# EAGLE design V4-AddOnESP32-V008-cc1101 (EAGLE 9.3.0)
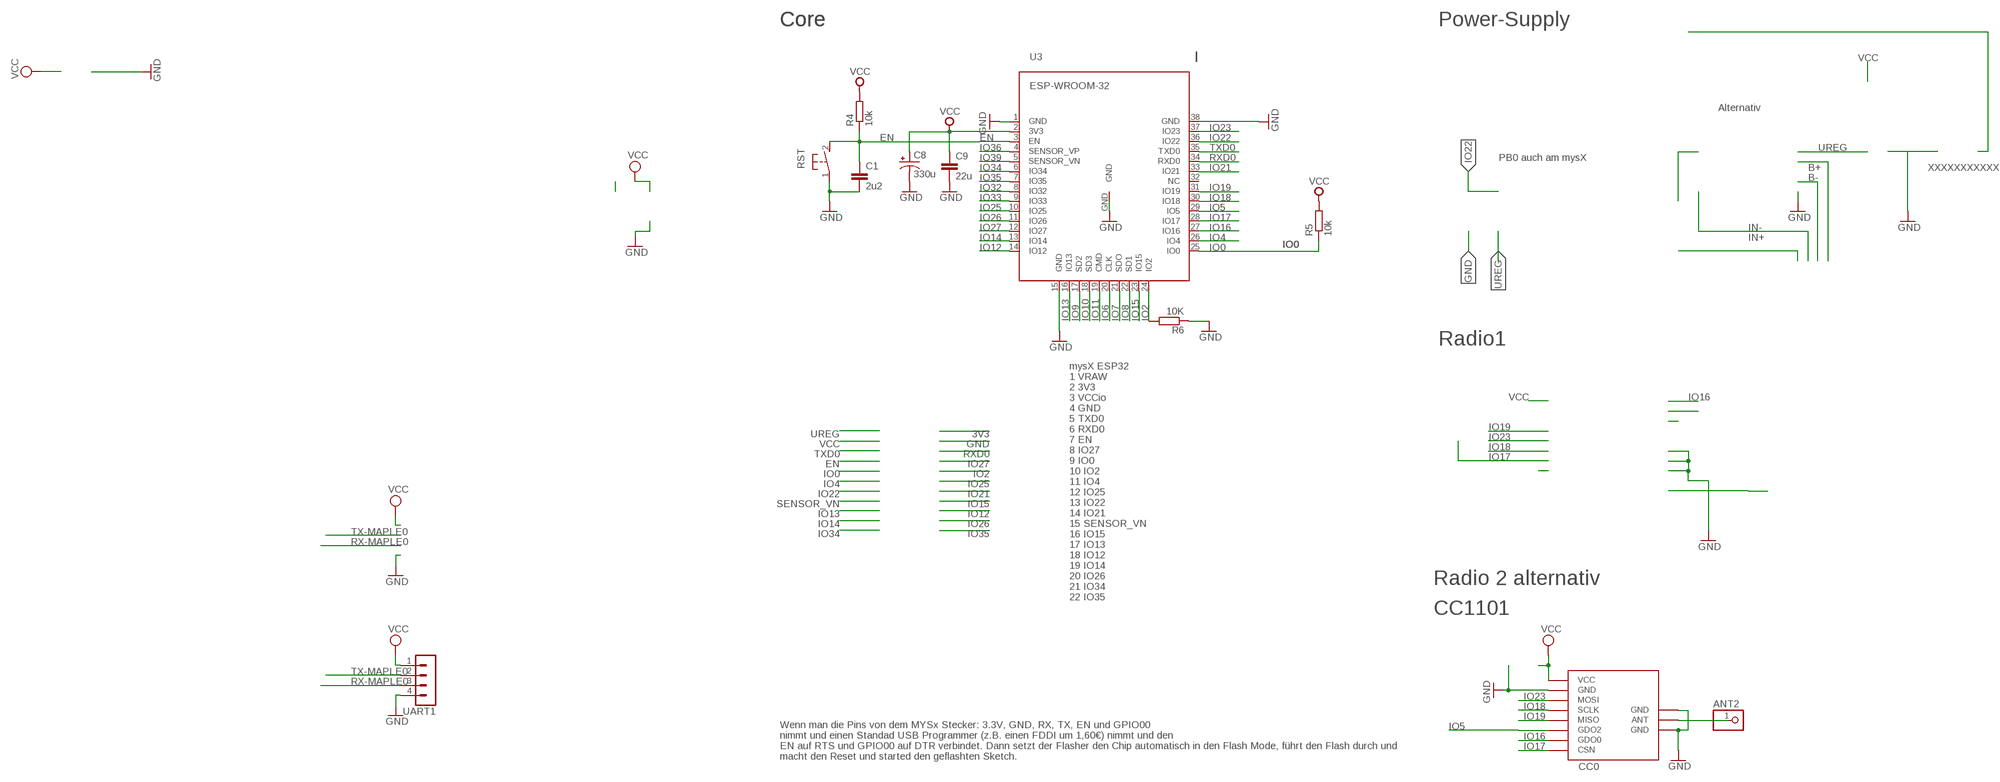
[diagram p0: schematic, sheet 1]

## Parts
ANT2  PINHD-1X1  [1X01]
C1  2u2  C-EUC0805  [C0805]
C8  330u  CAP_POLSMD  [VISHAY_C]
C9  22u  C-EUC0805  [C0805]
CC0  CC1101  CC1101_MODULE1SMD  [CC1101_MODULE1_SMD]
R4  10k  R-EU_M0805  [M0805]
R5  10k  R-EU_R0603  [R0603]
R6  10K  R-EU_M0805  [M0805]
RST  DTSM-3  [DTSM-3]
U3  ESP-WROOM-32  [ESP-WROOM-32]
UART1  MA04-1  [MA04-1]

## Nets
ANT0: ANT2.1 CC0.ANT
EN: C1.1 R4.1 RST.2 U3.3(EN)
GND [gnd]: C1.2 C8.- C9.2 CC0.GND@0(GND) CC0.GND@1(GND) CC0.GND@2(GND) R6.1 RST.1 U3.1(GND) U3.15(GND) U3.38(GND) U3.GND UART1.4
IO0: R5.1 U3.25(IO0)
IO2: R6.2 U3.24(IO2)
IO4: U3.26(IO4)
IO5: CC0.GDO2 U3.29(IO5)
IO6: U3.20(CLK)
IO7: U3.21(SDO)
IO8: U3.22(SD1)
IO9: U3.17(SD2)
IO10: U3.18(SD3)
IO11: U3.19(CMD)
IO12: U3.14(IO12)
IO13: U3.16(IO13)
IO14: U3.13(IO14)
IO15: U3.23(IO15)
IO16: CC0.GDO0 U3.27(IO16)
IO17: CC0.CSN U3.28(IO17)
IO18: CC0.SCLK U3.30(IO18)
IO19: CC0.MISO U3.31(IO19)
IO21: U3.33(IO21)
IO22: U3.36(IO22)
IO23: CC0.MOSI U3.37(IO23)
IO25: U3.10(IO25)
IO26: U3.11(IO26)
IO27: U3.12(IO27)
IO32: U3.8(IO32)
IO33: U3.9(IO33)
IO34: U3.6(IO34)
IO35: U3.7(IO35)
IO36: U3.4(SENSOR_VP)
IO39: U3.5(SENSOR_VN)
RX-MAPLE0: UART1.3
RXD0: U3.34(RXD0)
TX-MAPLE0: UART1.2
TXD0: U3.35(TXD0)
VCC [gnd]: C8.+ C9.1 CC0.VCC R4.2 R5.2 U3.2(3V3) UART1.1
Unconnected: U3.32(NC)

## Notes on the sheet
- Core | Core | Power-Supply
- Alternativ
- PB0 auch am mysX
- XXXXXXXXXXX
- Radio1
- Radio 2 alternativ
- mysX ESP32
  1 VRAW
  2 3V3
  3 VCCio
  4 GND
  5 TXD0
  6 RXD0
  7 EN
  8 IO27
  9 IO0
  10 IO2
  11 IO4
  12 IO25
  13 IO22
  14 IO21
  15 SENSOR_VN
  16 IO15
  17 IO13
  18 IO12
  19 IO14
  20 IO26
  21 IO34
  22 IO35
- CC1101
- Wenn man die Pins von dem MYSx Stecker: 3.3V, GND, RX, TX, EN und GPIO00
  nimmt und einen Standad USB Programmer (z.B. einen FDDI um 1,60€) nimmt und den
  EN auf RTS und GPIO00 auf DTR verbindet. Dann setzt der Flasher den Chip automatisch in den Flash Mode, führt den Flash durch und
  macht den Reset und started den geflashten Sketch.

## Library data of the parts
ANT2 = pinhead:PINHD-1X1: PIN HEADER
C1 C9 = rcl@1:C-EU: CAPACITOR, European symbol; SPICEPREFIX: C
C8 = SparkFun-Passives:CAP_POL: Capacitor Polarized These are standard SMD and PTH capacitors. Normally 10uF, 47uF, and 100uF in electrolytic and tantalum varieties. Always verify the external diameter of the through hole cap, it varies with capacity, voltage, and manufacturer. The EIA devices should be standard.
CC0 = wireless:CC1101_MODULE1: CC1101 wireless module for 433/868 MHz (sold from Aliexpress). DIL version for mounting with pin header (and SMD soldering) and SMD only variant available.
R4 = rcl@1:R-EU_: RESISTOR, European symbol; SPICEPREFIX: R
R5 R6 = rcl:R-EU_: RESISTOR, European symbol
RST = switch-tact:DTSM-3
U3 = esp32:ESP-WROOM-32
UART1 = con-lstb:MA04-1: PIN HEADER; OC_FARNELL: unknown; OC_NEWARK: unknown

## Net classes
0 default: width 0.305 mm, clearance 0.205 mm
1 gnd: width 0.406 mm, drill 0.635 mm, clearance 0.254 mm
2 vcc: width 0.406 mm, drill 0.406 mm, clearance 0.254 mm

## Board
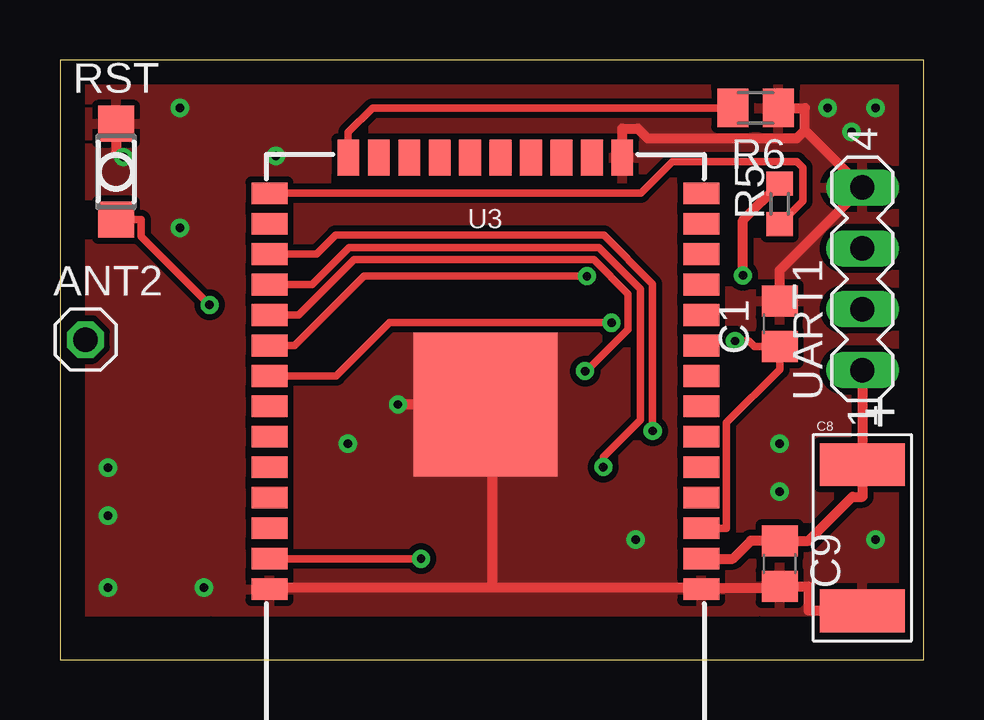
[diagram p1: board, top side]
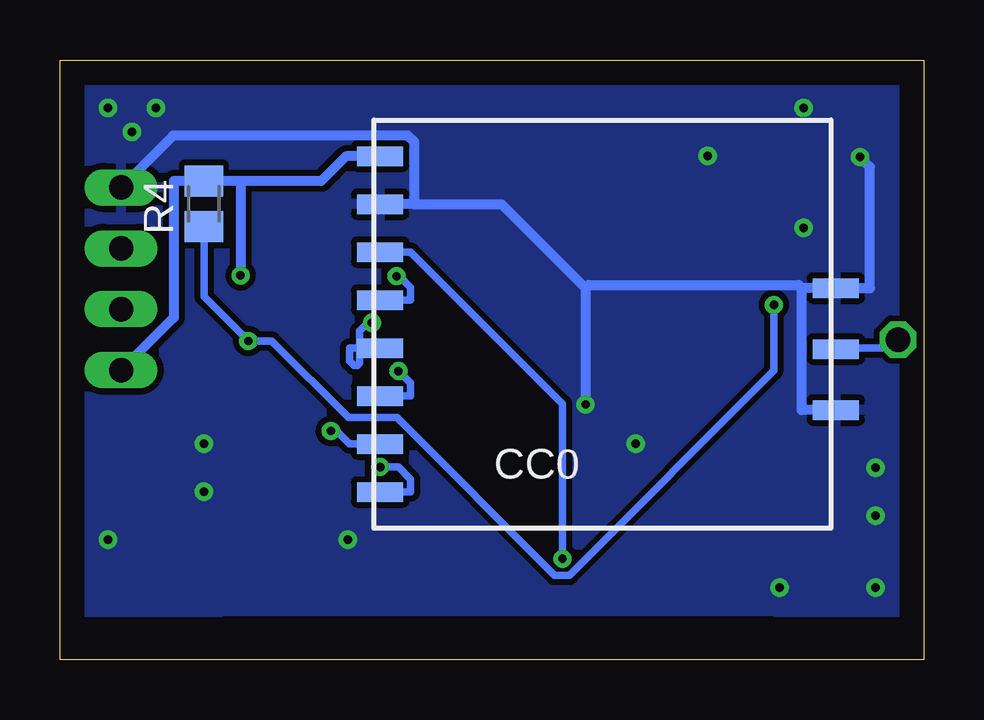
[diagram p2: board, bottom side, seen from below]

Size 36 x 25 mm. Coordinates in mm from the lower left corner, seen from the top.
Outline: 0,0 36,0 36,25 0,25 0,0
Copper layers (1*16): Top 0.035mm / dielectric 1.5mm / Bottom 0.035mm
Design rules "default": minimum track width 6mil, minimum drill 0.35mm, track to track 6mil, track to pad 6mil, pad to pad 6mil, via to via 6mil, smd to smd 6mil, copper to edge 40mil, drill to drill 6mil, minimum pad ring 10mil, minimum via ring 8mil, stop-mask expansion 4mil, vias tented up to drill 0mil, thermal gap 10mil

### Footprints (pad centres in the part's own frame; a part is rotated, then mirrored left to right if it is on the bottom)
1X01 = drill 1.016 octagon: 1 0,0
C0805 = smd 1.3 x 1.5: 1 -0.95,0; 2 0.95,0
VISHAY_C = smd 3.556 x 1.778: + 0,3.048; - 0,-3.048
CC1101_MODULE1_SMD = smd 1.93 x 0.813: ANT 19,5.96; CSN 0,0; GDO0 0,2; GDO2 0,4; GND@0 0,12; GND@1 19,8.5; GND@2 19,3.42; MISO 0,6; MOSI 0,10; SCLK 0,8; VCC 0,14
M0805 = smd 1.3 x 1.6: 1 -0.95,0; 2 0.95,0
R0603 = smd 1 x 1.1: 1 -0.85,0; 2 0.85,0
DTSM-3 = smd 1.5 x 1.5: 1 -2,0; 2 2,0
ESP-WROOM-32 = smd 0.9 x 1.5: 1 7.7,9; 2 6.43,9; 3 5.16,9; 4 3.89,9; 5 2.62,9; 6 1.35,9; 7 0.08,9; 8 -1.19,9; 9 -2.46,9; 10 -3.73,9; 11 -5,9; 12 -6.27,9; 13 -7.54,9; 14 -8.81,9; 25 -8.81,-9; 26 -7.54,-9; 27 -6.27,-9; 28 -5,-9; 29 -3.73,-9; 30 -2.46,-9; 31 -1.19,-9; 32 0.08,-9; 33 1.35,-9; 34 2.62,-9; 35 3.89,-9; 36 5.16,-9; 37 6.43,-9; 38 7.7,-9 | smd 1.5 x 0.9: 15 -10.3,5.715; 16 -10.3,4.445; 17 -10.3,3.175; 18 -10.3,1.905; 19 -10.3,0.635; 20 -10.3,-0.635; 21 -10.3,-1.905; 22 -10.3,-3.175; 23 -10.3,-4.445; 24 -10.3,-5.715 | smd 6 x 6: GND 0,0
MA04-1 = drill 1.016 long: 1 -3.81,0; 2 -1.27,0; 3 1.27,0; 4 3.81,0

### Placement (x,y rotation side)
ANT2  1.06,13.34 0 top
C1  30,14 90 top
C8  33.45,5.08 0 top
C9  30,4 270 top
CC0  22.66,6.99 0 bottom
R4  30,19 90 bottom
R5  30,19 90 top
R6  29,23 180 top
RST  2.34,20.34 270 top
U3  17.73,10.63 270 top
UART1  33.45,15.88 90 top

### Tracks (layer width: path | path; a pad name or v marks a point on that pad's centre or on a via)
ANT0
  Bottom 0.305: CC0.ANT 3.5,13 1.5,13 ANT2.1
EN  (via drill 0.35 pad 0.76)
  Top 0.305: RST.2 3.39,18.34 3.39,17.63 v6.24,14.78 | v28.14,13.28 28.72,13.28 28.95,13.05 C1.1 30,12.1 27.78,9.88 27.78,5.47 U3.3
  Bottom 0.305: v6.24,14.78 6.24,12.05 14.77,3.52 15.38,3.52 21.95,10.09 23.97,10.09 27.17,13.28 v28.14,13.28 30,15.14 30,17.09 R4.1
GND  (via drill 0.35 pad 0.76)
  Top 0.406: 16.66,10.63 | 16.66,10.63 | 16.66,10.63 | 16.66,10.63 | 16.66,10.63 | 16.66,10.63 | 16.66,10.63 16.65,10.63 16.62,10.63 16.57,10.63 16.46,10.63 16.04,10.63 16,10.63 14.27,10.63 v14.09,10.63 | 16.66,10.63 16.67,10.63 16.68,10.63 16.89,10.63 U3.GND 18,10.5 18,3 | RST.1 2.34,21.13 2.47,21.13 v2.65,20.95 | C1.2 30,16.23 UART1.4 31.06,22.08 | C8.- 31.22,2.03 31.22,3.04 31.21,3.05 30.6,3.05 C9.2 30,3 27,3 U3.1 26.5,3 18,3 | U3.15 23.45,22.14 24.09,22.14 24.49,21.74 30.72,21.74 31.06,22.08 | 31.06,22.08 31.06,23 R6.1 | 18,3 9,3 U3.38
  Bottom 0.406: 14.09,15.48 13.95,15.62 5.21,15.62 5.08,15.48 | v2.65,20.95 2.23,20.53 2.23,15.48 CC0.GND@1 4.37,15.48 5.08,15.48 | 14.09,15.48 v14.09,10.63 | 21.23,18.98 17.59,18.98 14.09,15.48 | 21.23,18.98 CC0.GND@0 | 21.23,18.98 21.23,21.58 21.5,21.85 31.28,21.85 UART1.4 | CC0.GND@2 5.08,10.4 5.08,15.48
  other vias: 5,23 5,18 2,3 2,6 2,8 6,3 12,9 9,21 34,23 32,23 33,22 30,7 30,9 24,5 34,5
  pour Top: 1,2 1,24 35,24 35,2
  pour Bottom: 1,24 35,24 35,2 1,2
IO0
  Top 0.305: U3.25 24.22,19.45 25.53,20.76 30.72,20.76 30.96,20.52 30.96,19.11 R5.1
IO2
  Top 0.305: U3.24 12.02,21.99 13.02,23 R6.2
IO5  (via drill 0.35 pad 0.76)
  Top 0.305: v21.89,12.03 21.95,12.03 23.68,13.76 23.68,15.24 22.25,16.67 12.26,16.67 9.96,14.37 9.79,14.37 U3.29
  Bottom 0.305: v21.89,12.03 21.38,11.52 21.38,10.98 CC0.GDO2
IO16  (via drill 0.35 pad 0.76)
  Top 0.305: U3.27 10.69,16.91 11.48,17.7 22.67,17.7 24.7,15.66 v24.7,9.53
  Bottom 0.305: v24.7,9.53 24.47,9.53 23.92,8.98 CC0.GDO0
IO17  (via drill 0.35 pad 0.76)
  Top 0.305: v22.65,8.03 22.65,8.44 24.19,9.98 24.19,15.46 22.46,17.18 12.05,17.18 10.51,15.63 9.79,15.63 U3.28
  Bottom 0.305: CC0.CSN 21.38,6.99 21.38,7.52 21.89,8.03 v22.65,8.03 | v22.65,8.03
IO18  (via drill 0.35 pad 0.76)
  Top 0.305: v21.97,15.98 12.68,15.98 9.79,13.1 U3.30
  Bottom 0.305: CC0.SCLK 21.38,14.98 21.38,15.52 21.85,15.98 v21.97,15.98 | v21.97,15.98
IO19  (via drill 0.35 pad 0.76)
  Top 0.305: U3.31 11.51,11.82 13.73,14.04 v23,14.04
  Bottom 0.305: v23,14.04 23.16,14.04 23.51,13.7 23.51,12.36 23.6,12.27 23.75,12.27 23.92,12.45 23.92,12.98 CC0.MISO
IO23  (via drill 0.35 pad 0.76)
  Top 0.305: U3.37 v15.05,4.21
  Bottom 0.305: v15.05,4.21 15.05,10.65 21.38,16.98 CC0.MOSI
VCC  (via drill 0.35 pad 0.76)
  Top 0.406: v28.47,16.01 28.47,18.32 R5.2 | U3.2 28.05,4.21 28.79,4.95 29.4,4.95 C9.1 31.21,4.95 33.04,6.78 33.45,6.78 C8.+ UART1.1
  Bottom 0.406: 28.47,19.95 R4.2 31.26,19.95 31.26,14.26 UART1.1 | 28.47,19.95 25.11,19.95 24.08,20.98 CC0.VCC | 28.47,19.95 v28.47,16.01